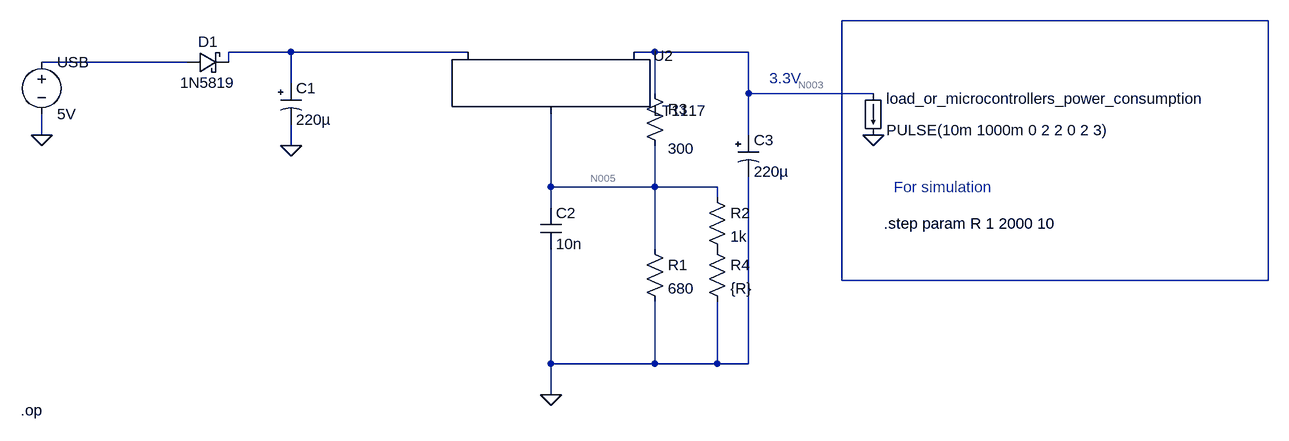
[diagram p0: schematic 3V3 power from USB A to USBC breakout.asc]
3V3 power from USB A to USBC breakout.asc, the LTspice schematic file:
Version 4
SHEET 1 956 740
WIRE -272 16 -928 16
WIRE -1776 64 -1872 64
WIRE -1504 64 -1776 64
WIRE -1216 64 -1248 64
WIRE -1072 64 -1216 64
WIRE -1936 80 -2160 80
WIRE -1872 80 -1872 64
WIRE -1776 112 -1776 64
WIRE -1216 128 -1216 64
WIRE -1072 128 -1072 64
WIRE -880 128 -1072 128
WIRE -2160 192 -2160 160
WIRE -1072 192 -1072 128
WIRE -1776 208 -1776 176
WIRE -1376 272 -1376 160
WIRE -1216 272 -1216 208
WIRE -1216 272 -1376 272
WIRE -1120 272 -1216 272
WIRE -1120 288 -1120 272
WIRE -1376 304 -1376 272
WIRE -1216 368 -1216 272
WIRE -928 416 -928 16
WIRE -272 416 -272 16
WIRE -272 416 -928 416
WIRE -1376 544 -1376 368
WIRE -1216 544 -1216 448
WIRE -1216 544 -1376 544
WIRE -1120 544 -1120 448
WIRE -1120 544 -1216 544
WIRE -1072 544 -1072 256
WIRE -1072 544 -1120 544
WIRE -1376 592 -1376 544
FLAG -1376 592 0
FLAG -2160 192 0
FLAG -880 192 0
FLAG -1776 208 0
SYMBOL PowerProducts\\LT1117 -1376 64 R0
SYMATTR InstName U2
SYMBOL voltage -2160 64 R0
WINDOW 123 0 0 Left 0
WINDOW 39 0 0 Left 0
SYMATTR InstName USB
SYMATTR Value 5V
SYMBOL res -1232 112 R0
WINDOW 3 36 101 Left 2
SYMATTR Value 300
SYMATTR InstName R3
SYMBOL cap -1392 304 R0
SYMATTR InstName C2
SYMATTR Value 10n
SYMBOL load -896 128 R0
WINDOW 123 0 0 Left 0
WINDOW 39 0 0 Left 0
SYMATTR InstName load_or_microcontrollers_power_consumption
SYMATTR Value PULSE(10m 1000m 0 2 2 0 2 3)
SYMBOL res -1232 352 R0
SYMATTR InstName R1
SYMATTR Value 680
SYMBOL schottky -1936 96 R270
WINDOW 0 32 32 VTop 2
WINDOW 3 0 32 VBottom 2
SYMATTR InstName D1
SYMATTR Value 1N5819
SYMATTR Description Diode
SYMATTR Type diode
SYMBOL polcap -1792 112 R0
WINDOW 3 24 56 Left 2
SYMATTR Value 220µ
SYMATTR InstName C1
SYMATTR Description Capacitor
SYMATTR Type cap
SYMATTR SpiceLine V=16 Irms=540m Rser=0.24 Lser=4.5n mfg="Würth Elektronik" pn="860160374017 WCAP-ATLL 8x11,5" type="Al electrolytic"
SYMBOL polcap -1088 192 R0
WINDOW 3 24 56 Left 2
SYMATTR Value 220µ
SYMATTR InstName C3
SYMATTR Description Capacitor
SYMATTR Type cap
SYMBOL res -1136 352 R0
SYMATTR InstName R4
SYMATTR Value {R}
SYMBOL res -1136 272 R0
SYMATTR InstName R2
SYMATTR Value 1k
TEXT -848 272 Left 2 ;For simulation
TEXT -1040 104 Left 2 ;3.3V
TEXT -864 328 Left 2 !.step param R 1 2000 10
TEXT -2192 616 Left 2 !.op

The netlist it stands for:
* 3V3 power from USB A to USBC breakout.asc
XU2 N005 N003 N002 LT1117
V§USB N004 0 5V
R3 N003 N005 300
C2 N005 0 10n
I§load_or_microcontrollers_power_consumption N003 0 PULSE(10m 1000m 0 2 2 0 2 3)
R1 N005 0 680
D1 N004 N002 1N5819
C1 N002 0 220µ V=16 Irms=540m Rser=0.24 Lser=4.5n mfg="Würth Elektronik" pn="860160374017 WCAP-ATLL 8x11,5" type="Al electrolytic"
C3 N003 0 220µ
R4 P001 0 {R}
R2 N005 P001 1k
.model D D
.lib standard.dio
* For simulation
* 3.3V
.step param R 1 2000 10
.op
.lib LT1117.lib
.backanno
.end

* Results of the author's LTspice run, read from the files saved beside the schematic
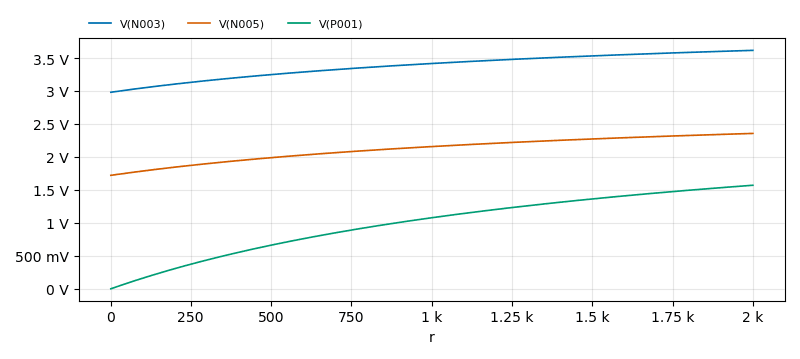
[diagram p1: Operating Point of 3V3 power from USB A to USBC breakout.asc, plotted from the saved traces]
* Operating Point, 1 run:
*   V(N003): 2.981 V at r=1 , 3.616 V at r=2 k, min 2.981 V, max 3.616 V
*   V(N005): 1.722 V at r=1 , 2.357 V at r=2 k, min 1.722 V, max 2.357 V
*   V(P001): 1.72 mV at r=1 , 1.571 V at r=2 k, min 1.72 mV, max 1.571 V
* From the log:
*   Semiconductor Device Operating Points:
*                           --- Diodes ---
*   Name:    d:u2:1      d:u2:2      d:u2:3      d:u2:5        d1
*   Model:    u2:im       u2:do      u2:55ua     u2:10k      1n5819
*   Id:      1.70e-03    1.25e-02    5.50e-05   -5.74e-09    1.43e-02
*   Vd:      1.80e+00    9.64e-01    3.06e+00   -5.74e-05    2.18e-01
*   Req:     1.00e-02    1.00e+01    1.00e-04    1.00e-04    2.49e+00
*   CAP:     0.00e+00    0.00e+00    0.00e+00    0.00e+00    1.20e-10
*                           --- VDMOSFET Transistors ---
*   Name:        m:u2:1
*   Model:        u2:q
*   Id:          1.25e-02
*   Vgs:         1.77e-04
*   Vds:         8.38e-01
*   Vth:         0.00e+00
*   Gm:          1.41e+02
*   Gds:         0.00e+00
*   Cgs:         0.00e+00
*   Cgd:         0.00e+00
*   Cbody:       0.00e+00